# Altium schematic sheet connector-top-j4-1.SchDoc: Connector - J4(Top) 1
size Letter; CompanyName: Brinton Engineering, LLC; Address1: 3479 Edison Way; Address2: Menlo Park CA 94025; Address3: +1 (877) 778-8435; Address4: brintonengineering.com; Revision: 1; SheetNumber: 1; SheetTotal: 1
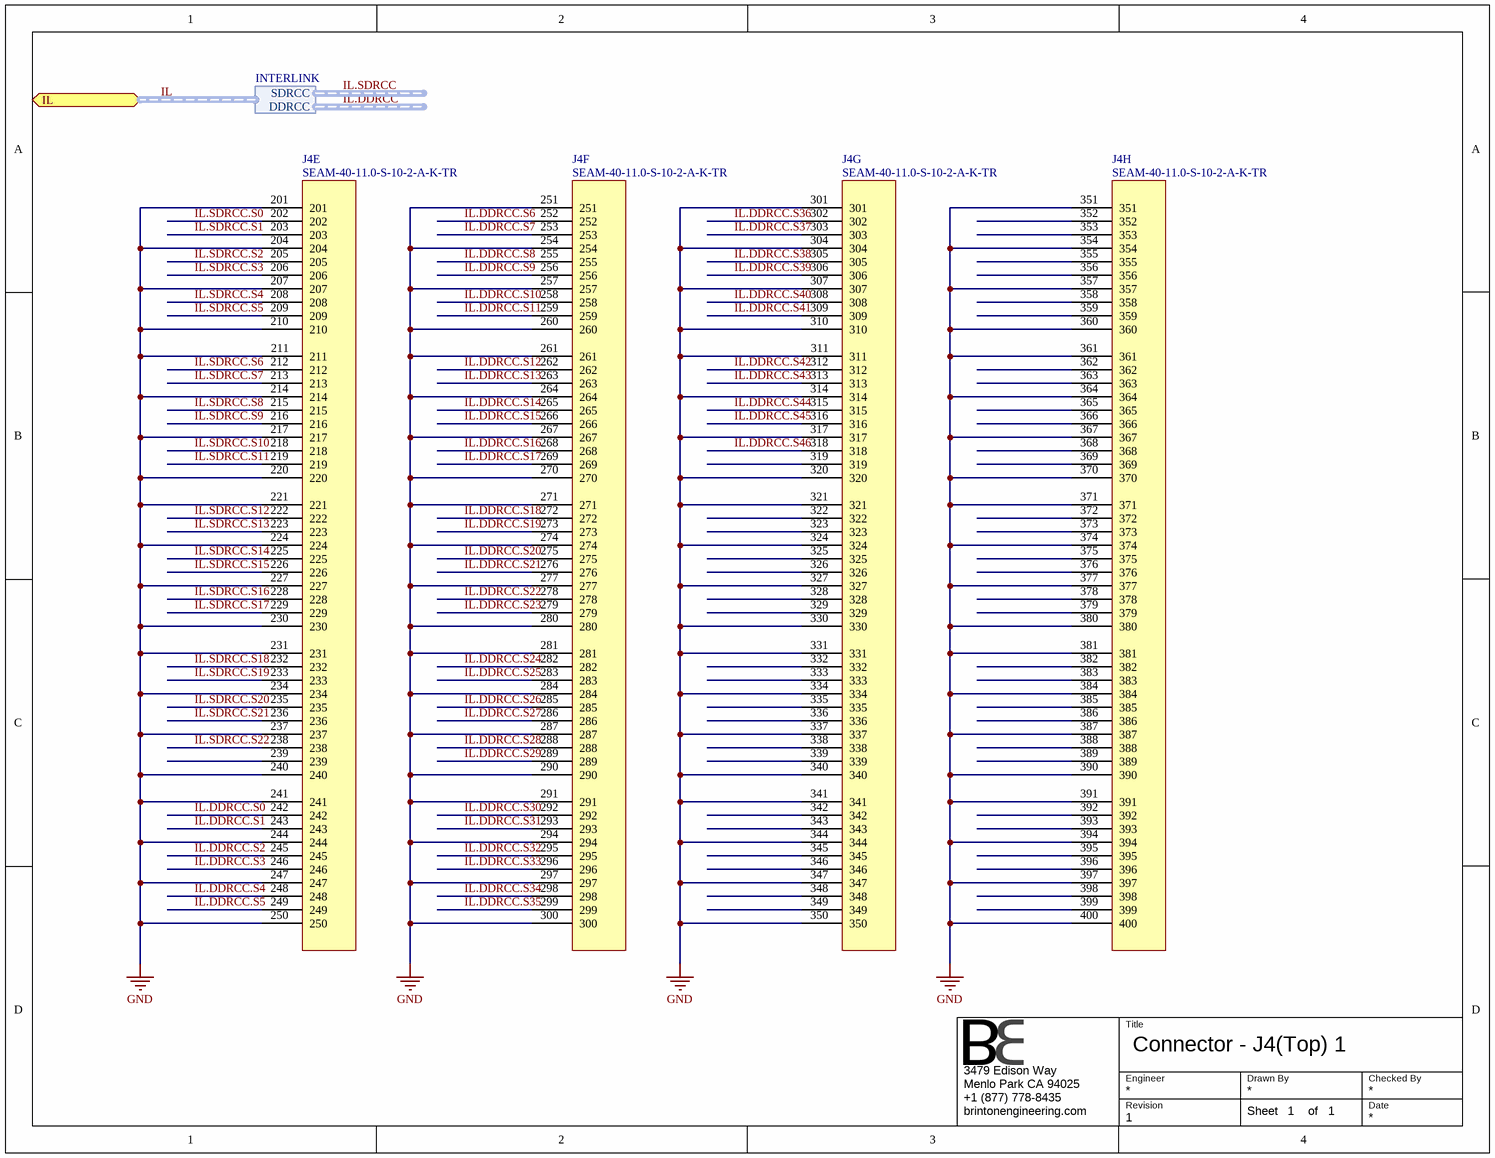
[diagram p0: connector-top-j4-1.SchDoc]

## Parts
J4  SEAM-40-11.0-S-10-2-A-K-TR  [SEAM-40-11.0-S-10-2-A-K-TR]  (parts E,F,G,H of 8)

## Ports
IL (harness INTERLINK)

## Harnesses
INTERLINK: DDRCC, SDRCC

## Nets
GND: J4.201 J4.204 J4.207 J4.210 J4.211 J4.214 J4.217 J4.220 J4.221 J4.224 J4.227 J4.230 J4.231 J4.234 J4.237 J4.240 J4.241 J4.244 J4.247 J4.250 J4.251 J4.254 J4.257 J4.260 J4.261 J4.264 J4.267 J4.270 J4.271 J4.274 J4.277 J4.280 J4.281 J4.284 J4.287 J4.290 J4.291 J4.294 J4.297 J4.300 J4.301 J4.304 J4.307 J4.310 J4.311 J4.314 J4.317 J4.320 J4.321 J4.324 J4.327 J4.330 J4.331 J4.334 J4.337 J4.340 J4.341 J4.344 J4.347 J4.350 J4.351 J4.354 J4.357 J4.360 J4.361 J4.364 J4.367 J4.370 J4.371 J4.374 J4.377 J4.380 J4.381 J4.384 J4.387 J4.390 J4.391 J4.394 J4.397 J4.400
IL.DDRCC.S0: J4.242
IL.DDRCC.S1: J4.243
IL.DDRCC.S2: J4.245
IL.DDRCC.S3: J4.246
IL.DDRCC.S4: J4.248
IL.DDRCC.S5: J4.249
IL.DDRCC.S6: J4.252
IL.DDRCC.S7: J4.253
IL.DDRCC.S8: J4.255
IL.DDRCC.S9: J4.256
IL.DDRCC.S10: J4.258
IL.DDRCC.S11: J4.259
IL.DDRCC.S12: J4.262
IL.DDRCC.S13: J4.263
IL.DDRCC.S14: J4.265
IL.DDRCC.S15: J4.266
IL.DDRCC.S16: J4.268
IL.DDRCC.S17: J4.269
IL.DDRCC.S18: J4.272
IL.DDRCC.S19: J4.273
IL.DDRCC.S20: J4.275
IL.DDRCC.S21: J4.276
IL.DDRCC.S22: J4.278
IL.DDRCC.S23: J4.279
IL.DDRCC.S24: J4.282
IL.DDRCC.S25: J4.283
IL.DDRCC.S26: J4.285
IL.DDRCC.S27: J4.286
IL.DDRCC.S28: J4.288
IL.DDRCC.S29: J4.289
IL.DDRCC.S30: J4.292
IL.DDRCC.S31: J4.293
IL.DDRCC.S32: J4.295
IL.DDRCC.S33: J4.296
IL.DDRCC.S34: J4.298
IL.DDRCC.S35: J4.299
IL.DDRCC.S36: J4.302
IL.DDRCC.S37: J4.303
IL.DDRCC.S38: J4.305
IL.DDRCC.S39: J4.306
IL.DDRCC.S40: J4.308
IL.DDRCC.S41: J4.309
IL.DDRCC.S42: J4.312
IL.DDRCC.S43: J4.313
IL.DDRCC.S44: J4.315
IL.DDRCC.S45: J4.316
IL.DDRCC.S46: J4.318
IL.SDRCC.S0: J4.202
IL.SDRCC.S1: J4.203
IL.SDRCC.S2: J4.205
IL.SDRCC.S3: J4.206
IL.SDRCC.S4: J4.208
IL.SDRCC.S5: J4.209
IL.SDRCC.S6: J4.212
IL.SDRCC.S7: J4.213
IL.SDRCC.S8: J4.215
IL.SDRCC.S9: J4.216
IL.SDRCC.S10: J4.218
IL.SDRCC.S11: J4.219
IL.SDRCC.S12: J4.222
IL.SDRCC.S13: J4.223
IL.SDRCC.S14: J4.225
IL.SDRCC.S15: J4.226
IL.SDRCC.S16: J4.228
IL.SDRCC.S17: J4.229
IL.SDRCC.S18: J4.232
IL.SDRCC.S19: J4.233
IL.SDRCC.S20: J4.235
IL.SDRCC.S21: J4.236
IL.SDRCC.S22: J4.238

Not connected (* = marked no-connect by the designer): J4 239 319 322 323 325 326 328 329 332 333 335 336 338 339 342 343 345 346 348 349 352 353 355 356 358 359 362 363 365 366 368 369 372 373 375 376 378 379 382 383 385 386 388 389 392 393 395 396 398 399

## Buses and harness runs
harness IL = port IL

## Notes on the sheet
- Title
- Engineer
- Revision
- Drawn By
- Checked By
- Date
- Sheet
- of

## Library data of the parts
J4 = SEAM-40-11.0-S-10-2-A-K-TR: Terminal Array Assembly, Surface Mount, 0.050" Pitch, 400 Pins; Manufacturer: Samtec; Manufacturer P/N: SEAM-40-11.0-S-10-2-A-K-TR